# Altium project ai_uwb_smart_flashlight.PrjPcb (part 1 of 6)
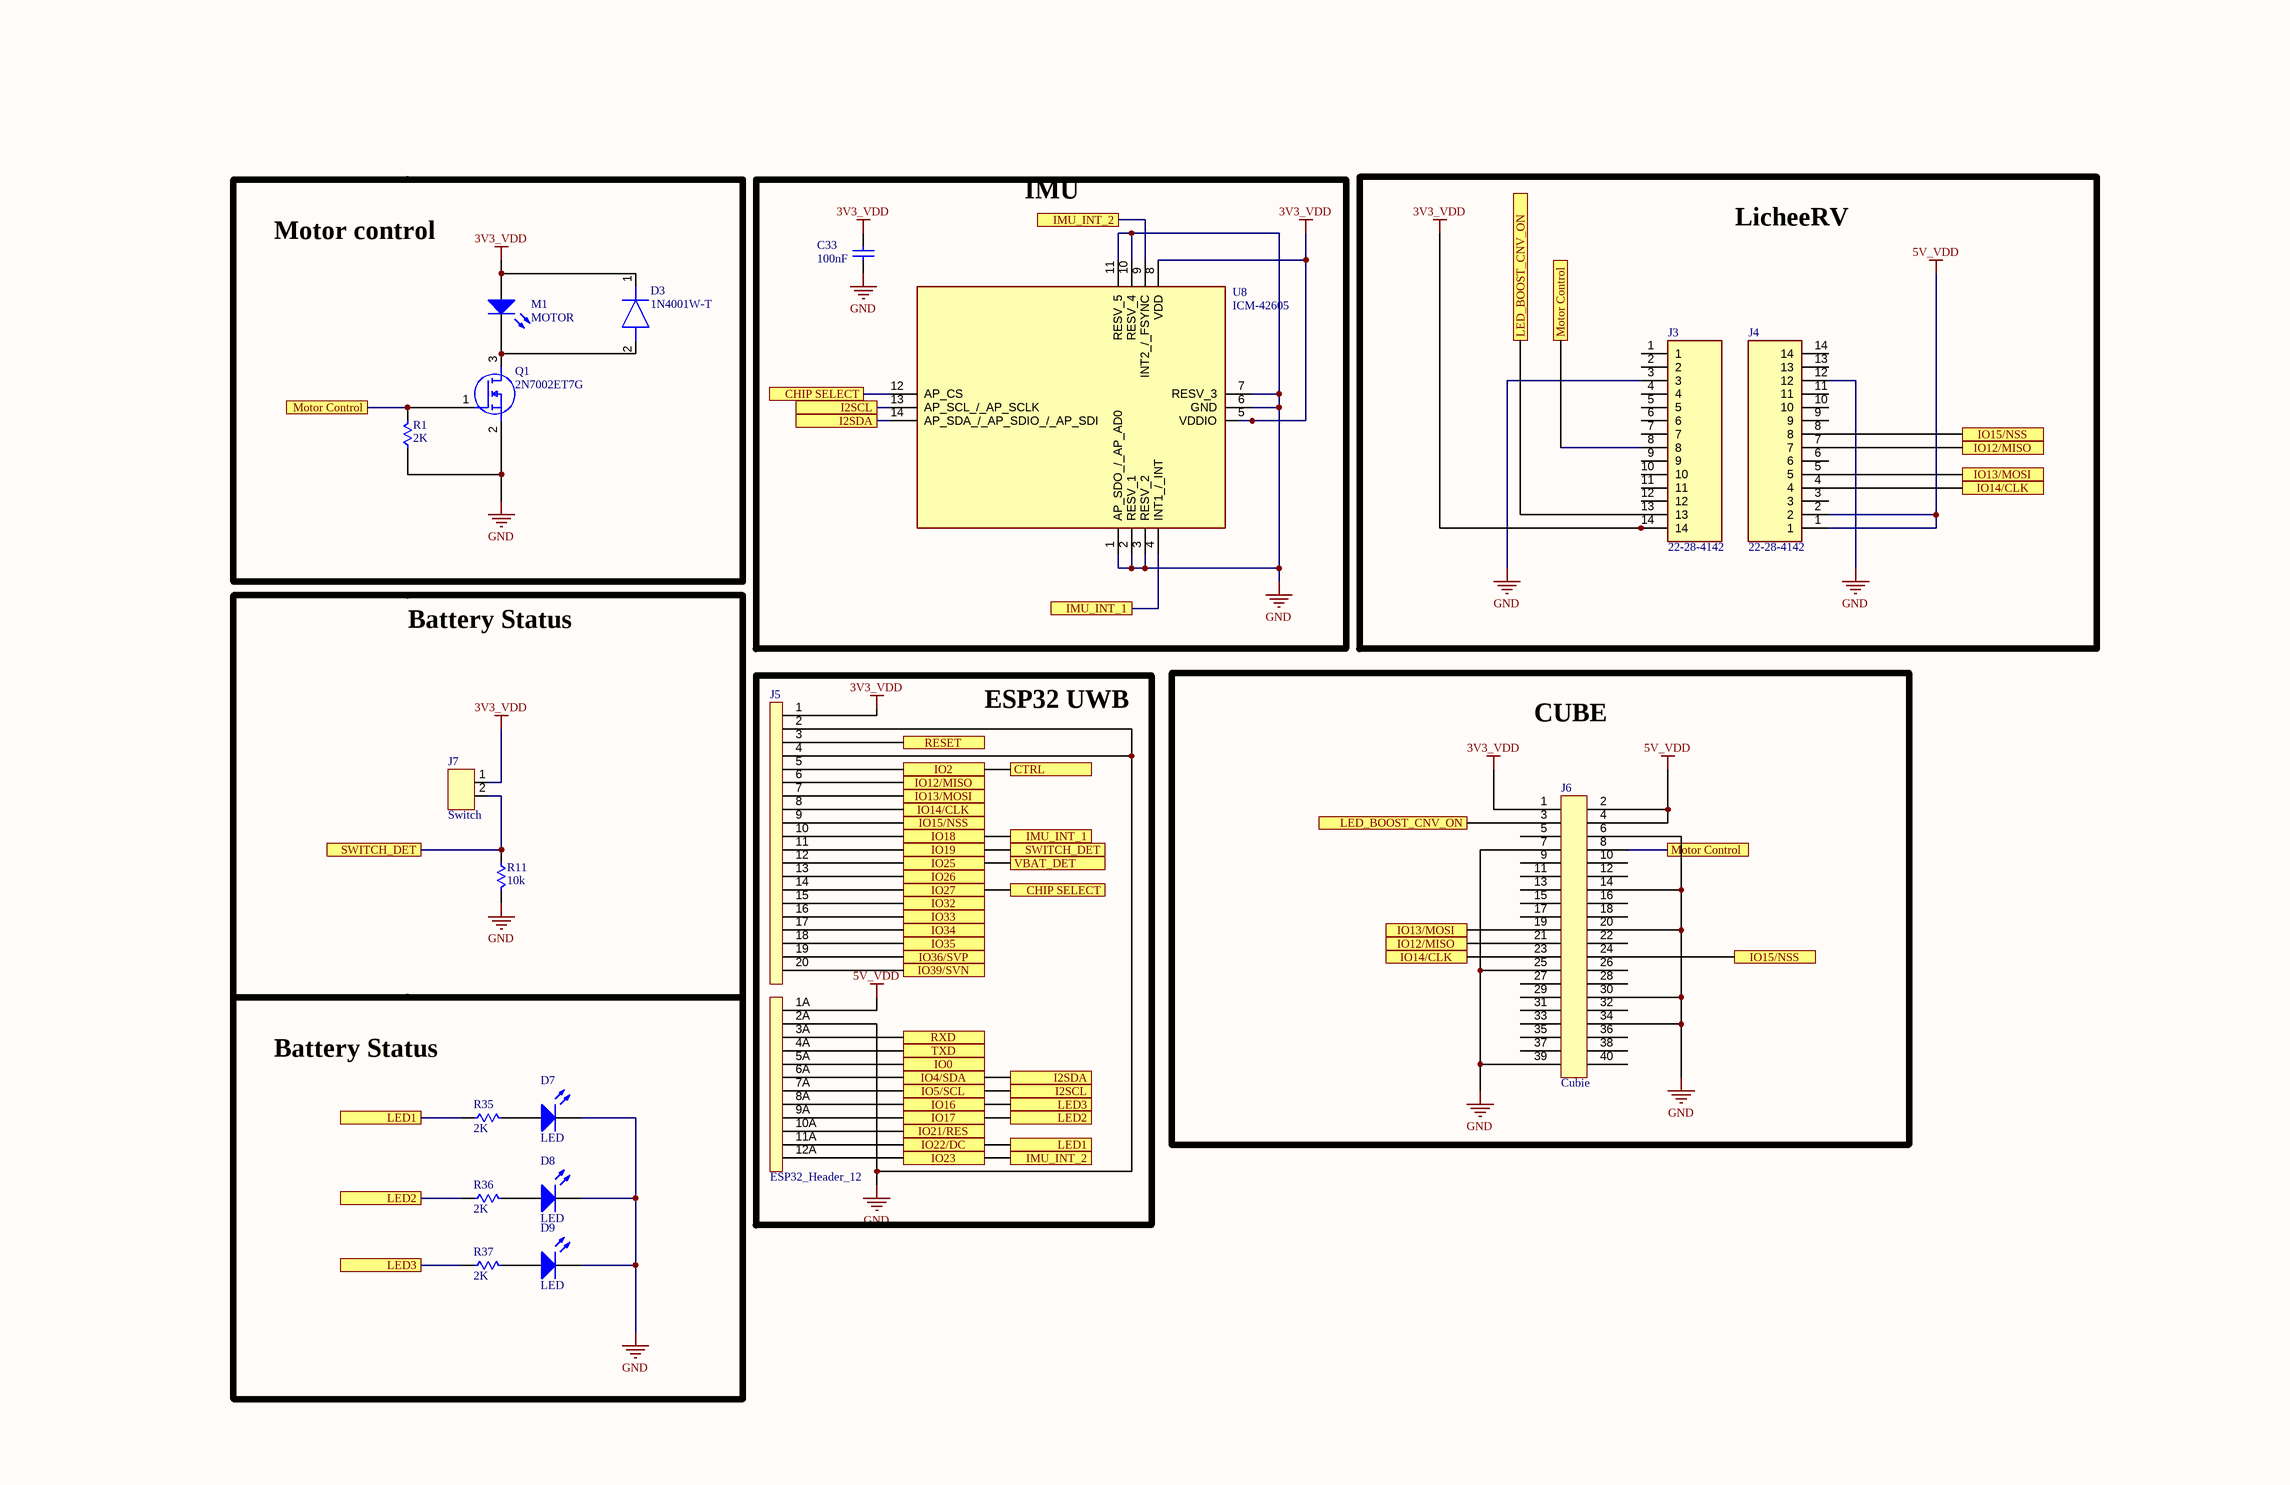
[diagram p0: MCU and Peripherals.SchDoc]
3 sheets, 85 parts. Net scope: flat (ports and power ports of the same name join across sheets).
Board files: PCB_LicheeRV.PcbDoc, PCB_Cube.PcbDoc
Sheets:
  MCU and Peripherals.SchDoc
  WiringSchematic.SchDoc
  Power supply.SchDoc

## Sheet MCU and Peripherals.SchDoc
size 431 x 279 mm; SheetNumber: 1; SheetTotal: 2

### Parts
C33  Capacitance: 100nF  [0603C]  (hidden comment: Capacitor)
D3  1N4001W-T  [SODFL3818X130N]
D7  LED  [SolderWires]
D8  LED  [SolderWires]
D9  LED  [SolderWires]
J3  22-28-4142  [HDRV14W63P0X254_1X14_3556X250X950P]
J4  22-28-4142  [HDRV14W63P0X254_1X14_3556X250X950P]
J5  ESP32_Header_12  [12P-2.54]
J6  Cubie  [40Pin]
J7  Switch  [SWITCH SOLDER]
M1  MOTOR  [SolderWires]
Q1  2N7002ET7G  [SOT96P237X111-3N]
R1  2K  [R0603]
R11  10k  [R0603]
R35  2K  [R0603]
R36  2K  [R0603]
R37  2K  [R0603]
U8  ICM-42605  [IIM42352]

### Blocks framed on the sheet
Motor control: D3 M1 Q1 R1
IMU: C33 U8
LicheeRV: J3 J4
Battery Status: J7 R11
ESP32 UWB: J5
CUBE: J6
Battery Status: D7-D9 R35-R37

### Ports
CHIP SELECT, CTRL, I2SCL, I2SDA, IMU_INT_1, IMU_INT_2, IO0, IO2, IO4/SDA, IO5/SCL, IO12/MISO, IO13/MOSI, IO14/CLK, IO15/NSS, IO16, IO17, IO18, IO19, IO21/RES, IO22/DC, IO23, IO25, IO26, IO27, IO32, IO33, IO34, IO35, IO36/SVP, IO39/SVN, LED1, LED2, LED3, LED_BOOST_CNV_ON, Motor Control, RESET, RXD, SWITCH_DET, TXD, VBAT_DET

### Nets
3V3_VDD: C33.2 D3.1(K) J3.14 J5.1 J6.1 J7.1 M1.1(A) U8.5(VDDIO) U8.8(VDD)
5V_VDD: J4.1 J4.2 J5.1A J6.2 J6.4
GND: C33.1 D7.2(K) D8.2(K) D9.2(K) J3.3 J4.12 J5.2 J5.2A J5.4 J6.6 J6.7 J6.14 J6.20 J6.25 J6.30 J6.34 J6.39 Q1.2(S) R1.1 R11.2 U8.1(AP_SDO_/_AP_AD0) U8.2(RESV_1) U8.3(RESV_2) U8.6(GND) U8.7(RESV_3) U8.10(RESV_4) U8.11(RESV_5)
NetD3_2: D3.2(A) M1.2(K) Q1.3(D)
NetD7_1: D7.1(A) R35.2
NetD8_1: D8.1(A) R36.2
NetD9_1: D9.1(A) R37.2
NetJ3_8: J3.8 J6.8 Q1.1(G) R1.2 ; port Motor Control
NetJ3_13: J3.13 J6.3 ; port LED_BOOST_CNV_ON
NetJ4_4: J4.4 J5.8 J6.23 ; port IO14/CLK
NetJ4_5: J4.5 J5.7 J6.19 ; port IO13/MOSI
NetJ4_7: J4.7 J5.6 J6.21 ; port IO12/MISO
NetJ4_8: J4.8 J5.9 J6.24 ; port IO15/NSS
NetJ5_3: J5.3 ; port RESET
NetJ5_3A: J5.3A ; port RXD
NetJ5_4A: J5.4A ; port TXD
NetJ5_5: J5.5 ; port IO2, port CTRL
NetJ5_5A: J5.5A ; port IO0
NetJ5_6A: J5.6A U8.14(AP_SDA_/_AP_SDIO_/_AP_SDI) ; port I2SDA, port IO4/SDA
NetJ5_7A: J5.7A U8.13(AP_SCL_/_AP_SCLK) ; port I2SCL, port IO5/SCL
NetJ5_8A: J5.8A R37.1 ; port LED3, port IO16
NetJ5_9A: J5.9A R36.1 ; port LED2, port IO17
NetJ5_10: J5.10 U8.4(INT1_/_INT) ; port IMU_INT_1, port IO18
NetJ5_10A: J5.10A ; port IO21/RES
NetJ5_11: J5.11 J7.2 R11.1 ; port SWITCH_DET, port IO19
NetJ5_11A: J5.11A R35.1 ; port LED1, port IO22/DC
NetJ5_12: J5.12 ; port IO25, port VBAT_DET
NetJ5_12A: J5.12A U8.9(INT2_/_FSYNC) ; port IMU_INT_2, port IO23
NetJ5_13: J5.13 ; port IO26
NetJ5_14: J5.14 U8.12(AP_CS) ; port CHIP SELECT, port IO27
NetJ5_15: J5.15 ; port IO32
NetJ5_16: J5.16 ; port IO33
NetJ5_17: J5.17 ; port IO34
NetJ5_18: J5.18 ; port IO35
NetJ5_19: J5.19 ; port IO36/SVP
NetJ5_20: J5.20 ; port IO39/SVN

Not connected (* = marked no-connect by the designer): J3 1 2 4 5 6 7 9 10 11 12; J4 3 6 9 10 11 13 14; J6 5(13) 9(17) 10(18) 11(19) 12(20) 13(21) 15(23) 16(24) 17 18 22 26 27 28 29 31 32 33 35 36 37 38 40

### Library data of the parts
C33 = 1: Cap Ceramic 0.1uF 50VDC X7R 10% SMD 0603 Paper T/R; Manufacturer: Samsung; Manufacturer Part Number: CL10B104KB8NNNC; Voltage Rating: 50V; ComponentLink1URL: http://www.kemet.com/docfinder?Partnumber=C0603C104K5RACTU; ComponentLink1Description: http://www.kemet.com/docfinder?Partnumber=C0603C104K5RACTU; ComponentLink2URL: https://datasheet.ciiva.com/25803/cl10b104kb8nnnc-25803393.pdf?src-supplier=Digi-Key; ComponentLink2Description: https://datasheet.ciiva.com/25803/cl10b104kb8nnnc-25803393.pdf?src-supplier=Digi-Key; ComponentLink3URL: https://datasheet.ciiva.com/26838/getdatasheetpartid-89097-26838411.pdf?src-supplier=Verical; ComponentLink3Description: https://datasheet.ciiva.com/26838/getdatasheetpartid-89097-26838411.pdf?src-supplier=Verical; ComponentLink4URL: https://datasheet.ciiva.com/29198/456651-da-01-en-vs-kondensator-0605-29198839.pdf?src-supplier=Conrad; ComponentLink4Description: https://datasheet.ciiva.com/29198/456651-da-01-en-vs-kondensator-0605-29198839.pdf?src-supplier=Conrad; Supplier 1: Digi-Key; Supplier Part Number 1: 1276-1000-1-ND; RoHS: Yes; Category: Ceramic Capacitors; Stock 1: 17279119; Pricing 1: 1=0,10000, 10=0,03200, 50=0,01720, 100=0,01410, 500=0,01008, 1000=0,00793 (USD); Mount: Surface Mount; Case/Package: 0603; Case Code (Metric): 1608; Case Code (Imperial): 0603; Material: Ceramic; Contact Plating: Tin; Min Operating Temperature: -55°C; Max Operating Temperature: 125°C; Tolerance: 10%; Package Quantity: 1; Packaging: Tape and Reel; Dielectric: X7R; Voltage: 50V; Voltage Rating (DC): 50V; Length: 1.6mm; Height: 0.8mm; Width: 0.031inch; Depth: 0.8mm; Thickness: 0.035inch; Radiation Hardening: No; Lead Free: Lead Free
D3 = 1N4001W-T: Diode; Manufacturer_Name: Rectron; Datasheet Link: https://gr.mouser.com/datasheet/2/345/1n4001w_1n4007w-2449105.pdf; Height: 1.3mm; Manufacturer_Part_Number: 1N4001W-T; Mouser Part Number: 583-1N4001W-T; Mouser Price/Stock: https://www.mouser.co.uk/ProductDetail/Rectron/1N4001W-T?qs=QNEnbhJQKvbnHIVMak28nQ%3D%3D
D7-D9 = LED3
J3 J4 = 1-826629-4: Connector; Manufacturer Part Number: 22-28-4142
M1 = LED3: LED
Q1 = 2N7002ET7G: MOSFET (N-Channel); Manufacturer_Name: onsemi; Datasheet Link: https://www.onsemi.com/pub/Collateral/2N7002E-D.PDF; Height: 1.11mm; Manufacturer_Part_Number: 2N7002ET7G; Mouser Part Number: 863-2N7002ET7G; Mouser Price/Stock: https://www.mouser.co.uk/ProductDetail/onsemi/2N7002ET7G?qs=l7cgNqFNU1iSXTOSQi2ecw%3D%3D; Arrow Part Number: 2N7002ET7G; Arrow Price/Stock: https://www.arrow.com/en/products/2n7002et7g/on-semiconductor?utm_currency=USD&region=nac
R1 R35-R37 = RC0603FR-072KL: RES SMD 2K OHM 1% 1/10W 0603; Manufacturer: Yageo; Temperature Coefficient: ±100ppm/°C; Power (Watts): 0.1W, 1/10W; Supplier 1: Digi-Key; Manufacturer Part Number: RC0603FR-072KL; RoHS: RoHS Compliant; Category: Resistors; Stock 1: 3425058; Pricing 1: 1=0.1, 10=0.015, 100=0.006, 1000=0.00268, 2500=0.00233 (USD); Tolerance: ±1%; Packaging: Cut Tape (CT); Features: Moisture Resistant; ComponentLink1URL: http://www.yageo.com/documents/recent/PYu-RC_Group_51_RoHS_L_8.pdf; ComponentLink1Description: http://www.yageo.com/documents/recent/PYu-RC_Group_51_RoHS_L_8.pdf; Supplier Part Number 1: 311-2.00KHRCT-ND; Part Status: Active; Composition: Thick Film; Operating Temperature: -55°C ~ 155°C; Package / Case: 0603 (1608 Metric); Supplier Device Package: 0603; Size / Dimension: 0.063" L x 0.032" W (1.60mm x 0.80mm); Height - Seated (Max): 0.022" (0.55mm); Failure Rate: -; Mouser Part Number: 603-RC0603FR-072KL; Arrow Part Number: RC0603FR-072KL
R11 = RC0603FR-072KL: Manufacturer Part Number: RK73H1JTTD1002F; Tolerance: ±1%; Temperature Coefficient: ±100ppm/°C; Power (Watts): 0.1W, 1/10W; Supplier 1: Digi-Key; Category: Resistors; Stock 1: 3425058; Pricing 1: 1=0.1, 10=0.015, 100=0.006, 1000=0.00268, 2500=0.00233 (USD); Packaging: Cut Tape (CT); Features: Moisture Resistant; ComponentLink1URL: http://www.yageo.com/documents/recent/PYu-RC_Group_51_RoHS_L_8.pdf; ComponentLink1Description: http://www.yageo.com/documents/recent/PYu-RC_Group_51_RoHS_L_8.pdf; Supplier Part Number 1: 311-2.00KHRCT-ND; Part Status: Active; Composition: Thick Film; Operating Temperature: -55°C ~ 155°C; Package / Case: 0603 (1608 Metric); Supplier Device Package: 0603; Size / Dimension: 0.063" L x 0.032" W (1.60mm x 0.80mm); Height - Seated (Max): 0.022" (0.55mm); Failure Rate: -; Mouser Part Number: 603-RC0603FR-072KL; Arrow Part Number: RC0603FR-072KL
U8 = ICM-42605: Accelerometer; Manufacturer_Name: TDK; Datasheet Link: https://3cfeqx1hf82y3xcoull08ihx-wpengine.netdna-ssl.com/wp-content/uploads/2020/09/DS-000292-ICM-42605-v1.5.pdf; Manufacturer Part Number: ICM-42605; Mouser Part Number: 410-ICM-42605; Mouser Price/Stock: https://www.mouser.co.uk/ProductDetail/TDK-InvenSense/ICM-42605?qs=gZXFycFWdAO0MPgeewGYjQ%3D%3D; Arrow Part Number: ICM-42605; Arrow Price/Stock: https://www.arrow.com/en/products/icm-42605/invensense?utm_currency=USD&region=nac

## Sheet WiringSchematic.SchDoc
size 420 x 297 mm; SheetNumber: 3; SheetTotal: 3
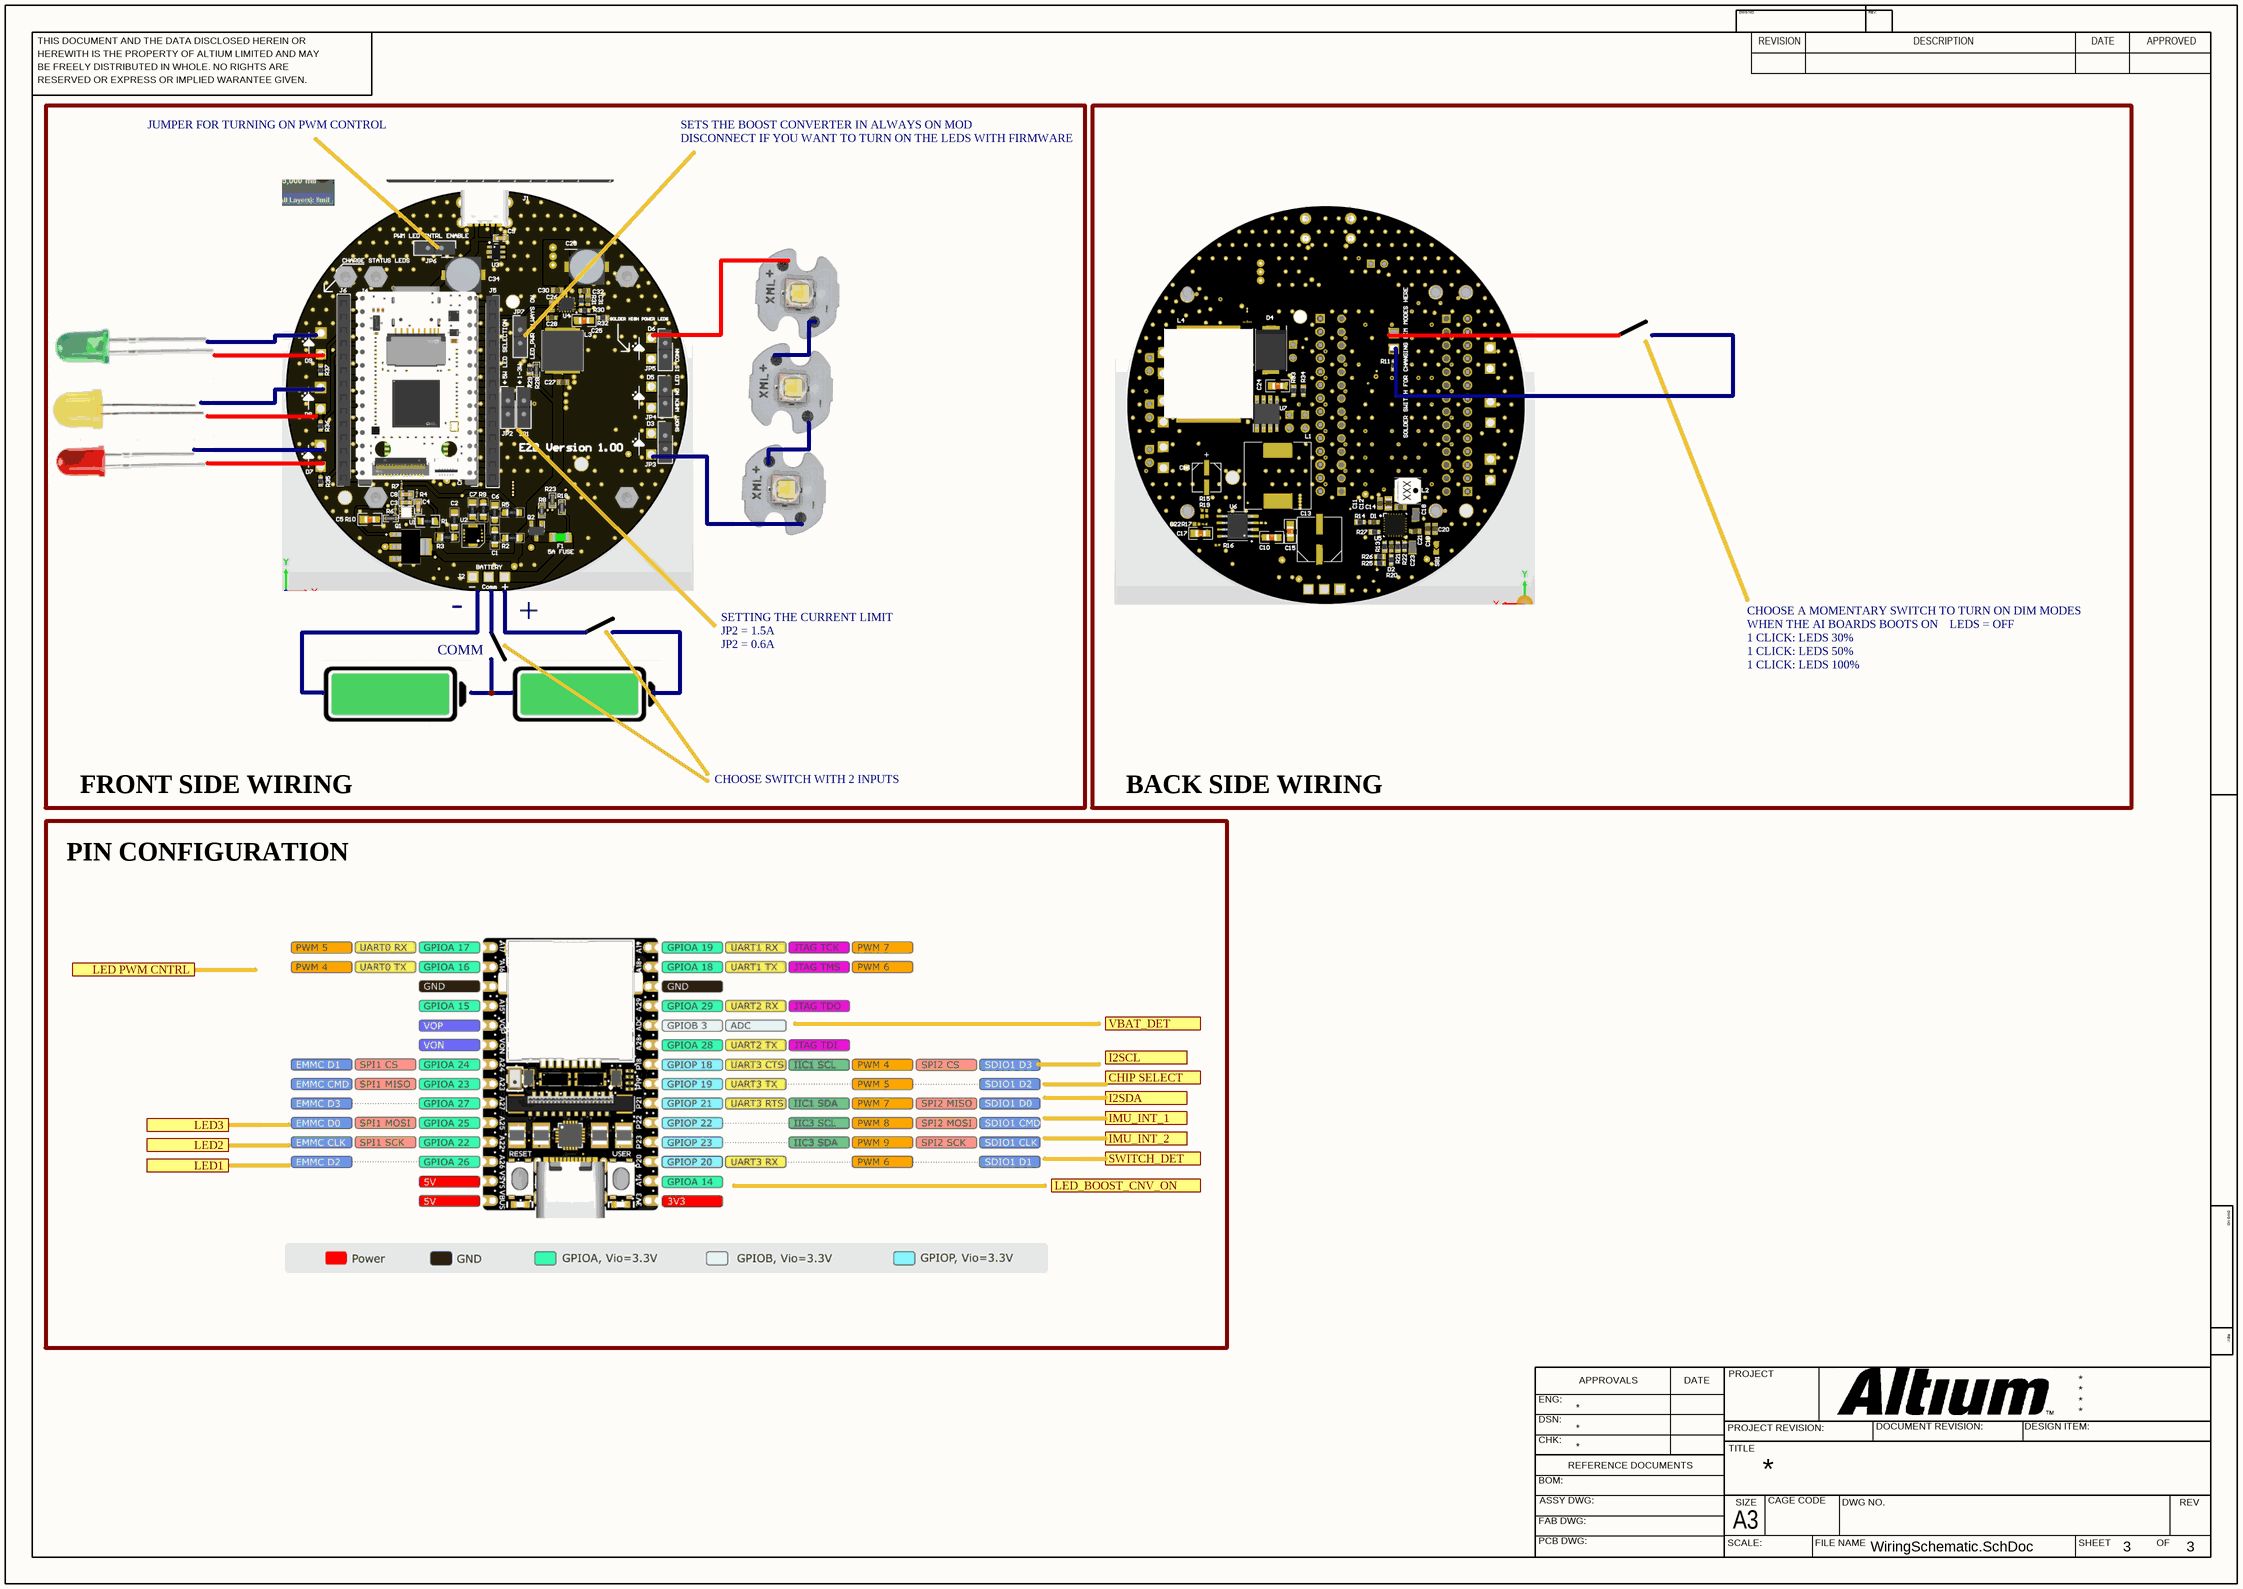
[diagram p1: WiringSchematic.SchDoc]

### Ports
CHIP SELECT, I2SCL, I2SDA, IMU_INT_1, IMU_INT_2, LED1, LED2, LED3, LED PWM CNTRL, LED_BOOST_CNV_ON, SWITCH_DET, VBAT_DET

### Notes on the sheet
- JUMPER FOR TURNING ON PWM CONTROL
- SETS THE BOOST CONVERTER IN ALWAYS ON MOD
- DISCONNECT IF YOU WANT TO TURN ON THE LEDS WITH FIRMWARE
- COMM
- -
- +
- SETTING THE CURRENT LIMIT
- JP2 = 1.5A
- JP2 = 0.6A
- CHOOSE A MOMENTARY SWITCH TO TURN ON DIM MODES
- 1 CLICK: LEDS 30%
- WHEN THE AI BOARDS BOOTS ON
- 1 CLICK: LEDS 50%
- 1 CLICK: LEDS 100%
- LEDS = OFF
- FRONT SIDE WIRING
- CHOOSE SWITCH WITH 2 INPUTS
- BACK SIDE WIRING
- PIN CONFIGURATION
- THIS DOCUMENT AND THE DATA DISCLOSED HEREIN OR
- HEREWITH IS THE PROPERTY OF ALTIUM LIMITED AND MAY
- DWG NO:
- REVISION
- REV:
- DESCRIPTION
- DATE
- APPROVED
- BE FREELY DISTRIBUTED IN WHOLE. NO RIGHTS ARE
- RESERVED OR EXPRESS OR IMPLIED WARANTEE GIVEN.
- ENG:
- APPROVALS
- PROJECT
- DSN:
- CHK:
- REFERENCE DOCUMENTS
- PROJECT REVISION:
- TITLE
- DOCUMENT REVISION:
- DESIGN ITEM:
- BOM:
- FAB DWG:
- PCB DWG:
- ASSY DWG:
- SCALE:
- A3
- SIZE
- CAGE CODE
- FILE NAME
- DWG NO.
- SHEET
- OF
- REV

## Sheet Power supply.SchDoc
size 558 x 431 mm; SheetNumber: 1; SheetTotal: 3
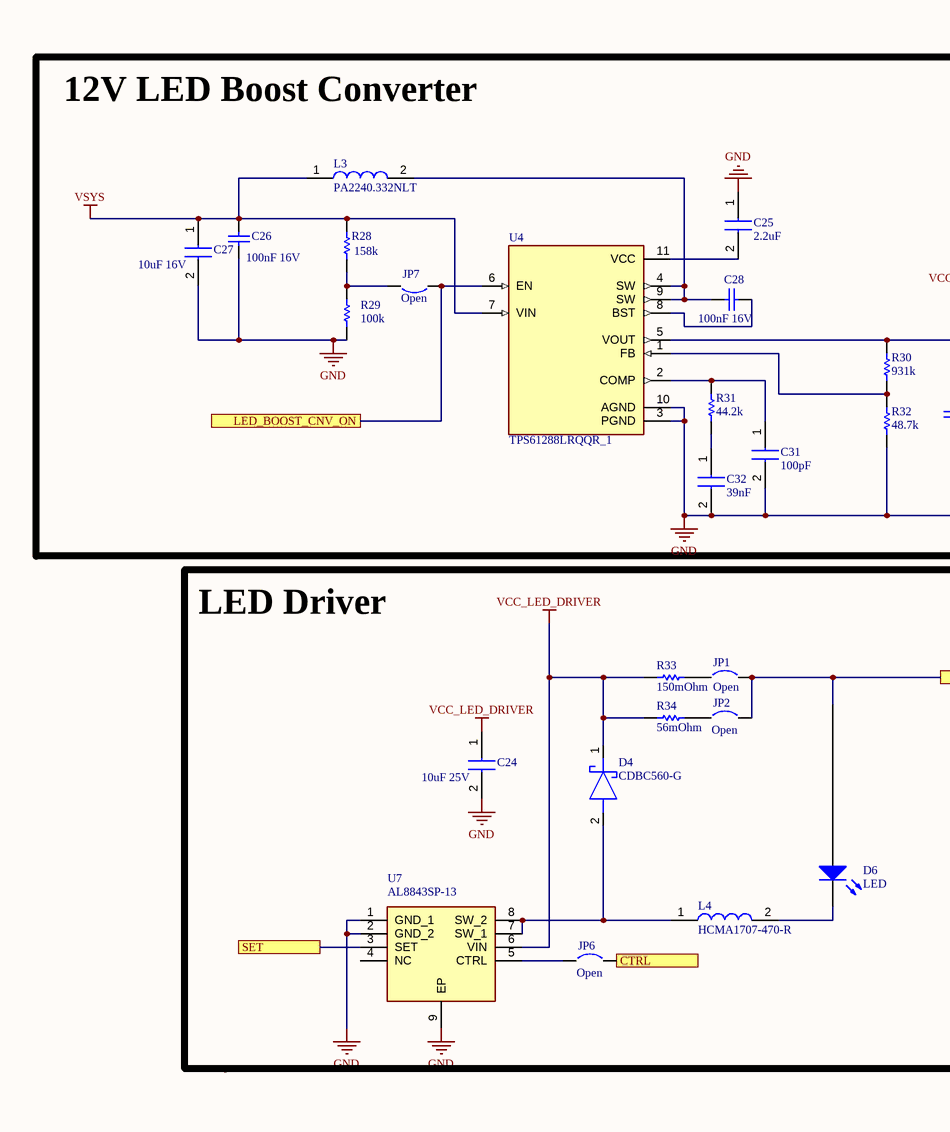
[diagram p2: Power supply.SchDoc, left]
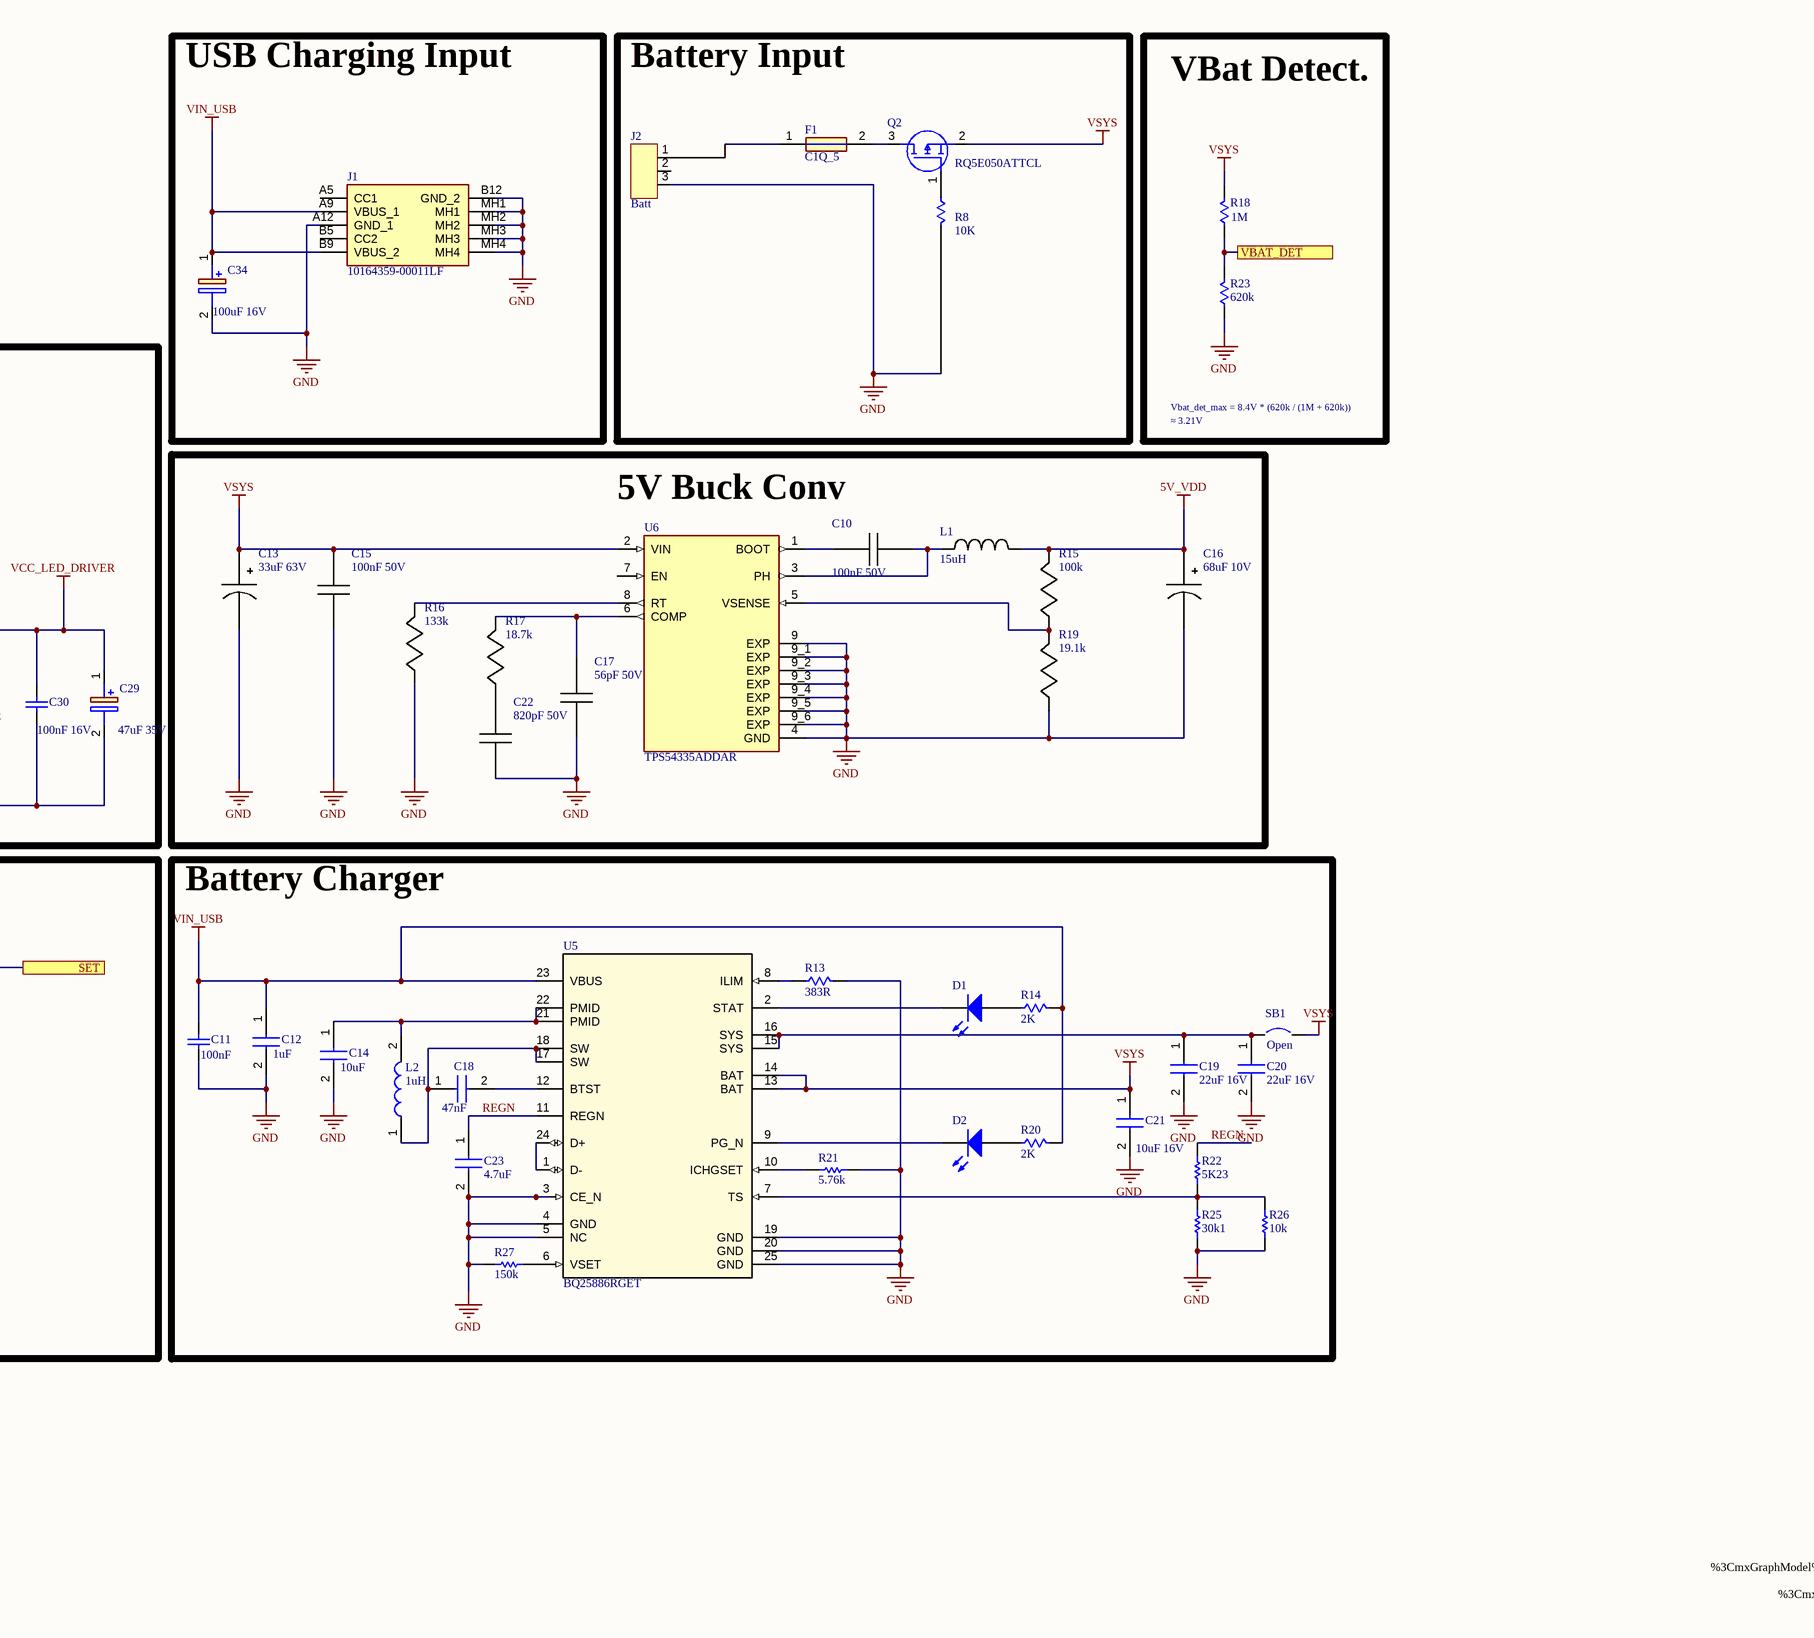
[diagram p3: Power supply.SchDoc, right]

### Parts
C10  100nF 50V  [0805C]
C11  100nF  [C0603]
C12  1uF  [C0805]
C13  33uF 63V  [SM_RADIAL_8MM]
C14  10uF  [C0603]
C15  100nF 50V  [0805C]
C16  68uF 10V  [SM_RADIAL_5MM]
C17  56pF 50V  [0805C]
C18  47nF  [C0805]
C19  22uF 16V  [C0603]
C20  22uF 16V  [C0603]
C21  10uF 16V  [C0603]
C22  820pF 50V  [0402]
C23  4.7uF  [C0805]
C24  10uF 25V  [0805C]
C25  2.2uF  [0805C]
C26  100nF 16V  [C0603]
C27  10uF 16V  [C0603]
C28  100nF 16V  [C0603]
C29  47uF 35V  [CAPAE660X550N]
C30  100nF 16V  [C0603]
C31  100pF  [C0603]
C32  39nF  [C0603]
C34  100uF 16V  [CAPAE660X770N]
D1  LED3  [C0603]  (value not drawn)
D2  LED3  [C0603]  (value not drawn)
D4  CDBC560-G  [DIOM7959X262N]
D6  LED  [SolderWires]
F1  C1Q_5  [FUSC3216X78N]
J1  10164359-00011LF  [1016435900011LF]
J2  Batt  [Batt]
JP1  Open  [HDRV2W87P0X254_1X2_768X249X1494P - duplicate]
JP2  Open  [HDRV2W87P0X254_1X2_768X249X1494P - duplicate]
JP6  Open  [HDRV2W87P0X254_1X2_768X249X1494P - duplicate]
JP7  Open  [HDRV2W87P0X254_1X2_768X249X1494P - duplicate]
L1  15uH  [SRR1280]
L2  1uH  [VLS5045EX330M]
L3  PA2240.332NLT  [PA2240332NLT]
L4  HCMA1707-470-R  [INDPM172168X700N]
Q2  RQ5E050ATTCL  [SOT95P280X100-3N]
R8  10K  [0603]
R13  383R  [R0603]
R14  2K  [R0603]
R15  100k  [0402]
R16  133k  [0201]
R17  18.7k  [0201]
R18  1M  [0603]
R19  19.1k  [0402]
R20  2K  [R0603]
R21  5.76k  [R0603]  (no BOM)
R22  5K23  [R0603]  (no BOM)
R23  620k  [0603]
R25  30k1  [R0603]  (no BOM)
R26  10k  [R0603]  (no BOM)
R27  150k  [R0603]  (no BOM)
R28  158k  [0603]
R29  100k  [R0603]
R30  931k  [R0603]
R31  44.2k  [R0603]
R32  48.7k  [R0603]
R33  150mOhm  [R0603]
R34  56mOhm  [R0603]
SB1  Open  [SB_0603]
U4  TPS61288LRQQR_1  [CONV_TPS61288LRQQR]
U5  BQ25886RGET  [RGE0024H]
U6  TPS54335ADDAR  [IC_TPS54335ADDAR]
U7  AL8843SP-13  [SOIC127P600X163-9N]

### Blocks framed on the sheet
USB Charging Input: C34 J1
Battery Input: F1 J2 Q2 R8
VBat Detect.: R18 R23
12V LED Boost Converter: C25-C32 JP7 L3 R28-R32 U4
5V Buck Conv: C10 C13 C15-C17 C22 L1 R15-R17 R19 U6
LED Driver: C24 D4 D6 JP1 JP2 JP6 L4 R33 R34 U7
Battery Charger: C11 C12 C14 C18-C21 C23 D1 D2 L2 R13 R14 R20-R22 R25-R27 SB1 U5

### Ports
CTRL, LED_BOOST_CNV_ON, SET, VBAT_DET

### Nets
5V_VDD: C16.1(+) L1.2 R15.1
GND: C11.1 C12.2 C13.2(-) C14.2 C15.1 C16.2(-) C17.2 C19.2 C20.2 C21.2 C22.2 C23.2 C24.2 C25.1 C26.1 C27.2 C29.2(-) C30.1 C31.2 C32.2 C34.2(-) J1.A12(GND_1) J1.B12(GND_2) J1.MH1 J1.MH2 J1.MH3 J1.MH4 J2.3 R8.2 R13.2 R16.2 R19.2 R21.2 R23.1 R25.2 R26.2 R27.1 R29.1 R32.1 U4.3(PGND) U4.10(AGND) U5.3(CE_N) U5.4(GND) U5.5(NC) U5.19(GND) U5.20(GND) U5.25(GND) U6.4(GND) U6.9(EXP) U6.9_1(EXP) U6.9_2(EXP) U6.9_3(EXP) U6.9_4(EXP) U6.9_5(EXP) U6.9_6(EXP) U7.1(GND_1) U7.2(GND_2) U7.9(EP)
VCC_LED_DRIVER: C24.1 C29.1(+) C30.2 D4.1(K) R30.2 R33.2 R34.2 U4.5(VOUT) U7.6(VIN)
VIN_USB: C11.2 C12.1 C34.1(+) J1.A9(VBUS_1) J1.B9(VBUS_2) R14.2 R20.2 U5.23(VBUS)
VSYS: C13.1(+) C15.2 C21.1 C26.2 C27.1 L3.1 Q2.2(S) R18.2 R28.2 SB1.2 U4.7(VIN) U5.13(BAT) U5.14(BAT) U6.2(VIN)
REGN: C23.1 R22.1 U5.11(REGN)
NetC10_1: C10.1 U6.1(BOOT)
NetC10_2: C10.2 L1.1 U6.3(PH)
NetC14_1: C14.1 L2.2 U5.21(PMID) U5.22(PMID)
NetC17_1: C17.1 R17.1 U6.6(COMP)
NetC18_1: C18.1 L2.1 U5.17(SW) U5.18(SW)
NetC18_2: C18.2 U5.12(BTST)
NetC19_1: C19.1 C20.1 SB1.1 U5.15(SYS) U5.16(SYS)
NetC22_1: C22.1 R17.2
NetC25_2: C25.2 U4.11(VCC)
NetC28_1: C28.1 U4.8(BST)
NetC28_2: C28.2 L3.2 U4.4(SW) U4.9(SW)
NetC31_1: C31.1 R31.2 U4.2(COMP)
NetC32_1: C32.1 R31.1
NetD1_1: D1.1(A) R14.1
NetD1_2: D1.2(K) U5.2(STAT)
NetD2_1: D2.1(A) R20.1
NetD2_2: D2.2(K) U5.9(PG_N)
NetD4_2: D4.2(A) L4.1 U7.7(SW_1) U7.8(SW_2)
NetD6_1: D6.1(A) JP1.2 JP2.2 U7.3(SET) ; port SET
NetD6_2: D6.2(K) L4.2
NetF1_1: F1.1 J2.1
NetF1_2: F1.2 Q2.3(D)
NetJ3_13: JP7.1 U4.6(EN) ; port LED_BOOST_CNV_ON
NetJ5_5: JP6.2 ; port CTRL
NetJ5_12: R18.1 R23.2 ; port VBAT_DET
NetJP1_1: JP1.1 R33.1
NetJP2_1: JP2.1 R34.1
NetJP6_1: JP6.1 U7.5(CTRL)
NetJP7_2: JP7.2 R28.1 R29.2
NetQ2_1: Q2.1(G) R8.1
NetR13_1: R13.1 U5.8(ILIM)
NetR15_2: R15.2 R19.1 U6.5(VSENSE)
NetR16_1: R16.1 U6.8(RT)
NetR21_1: R21.1 U5.10(ICHGSET)
NetR22_2: R22.2 R25.1 R26.1 U5.7(TS)
NetR27_2: R27.2 U5.6(VSET)
NetR30_1: R30.1 R32.2 U4.1(FB)
NetU5_1: U5.1(D-) U5.24(D+)

Not connected (* = marked no-connect by the designer): J1 A5(CC1) B5(CC2); J2 2; U6 7(EN); U7 4(NC)
### Notes on the sheet
- Vbat_det_max = 8.4V * (620k / (1M + 620k))
- ≈ 3.21V